# EAGLE design cff3100if (EAGLE 9.6.2)
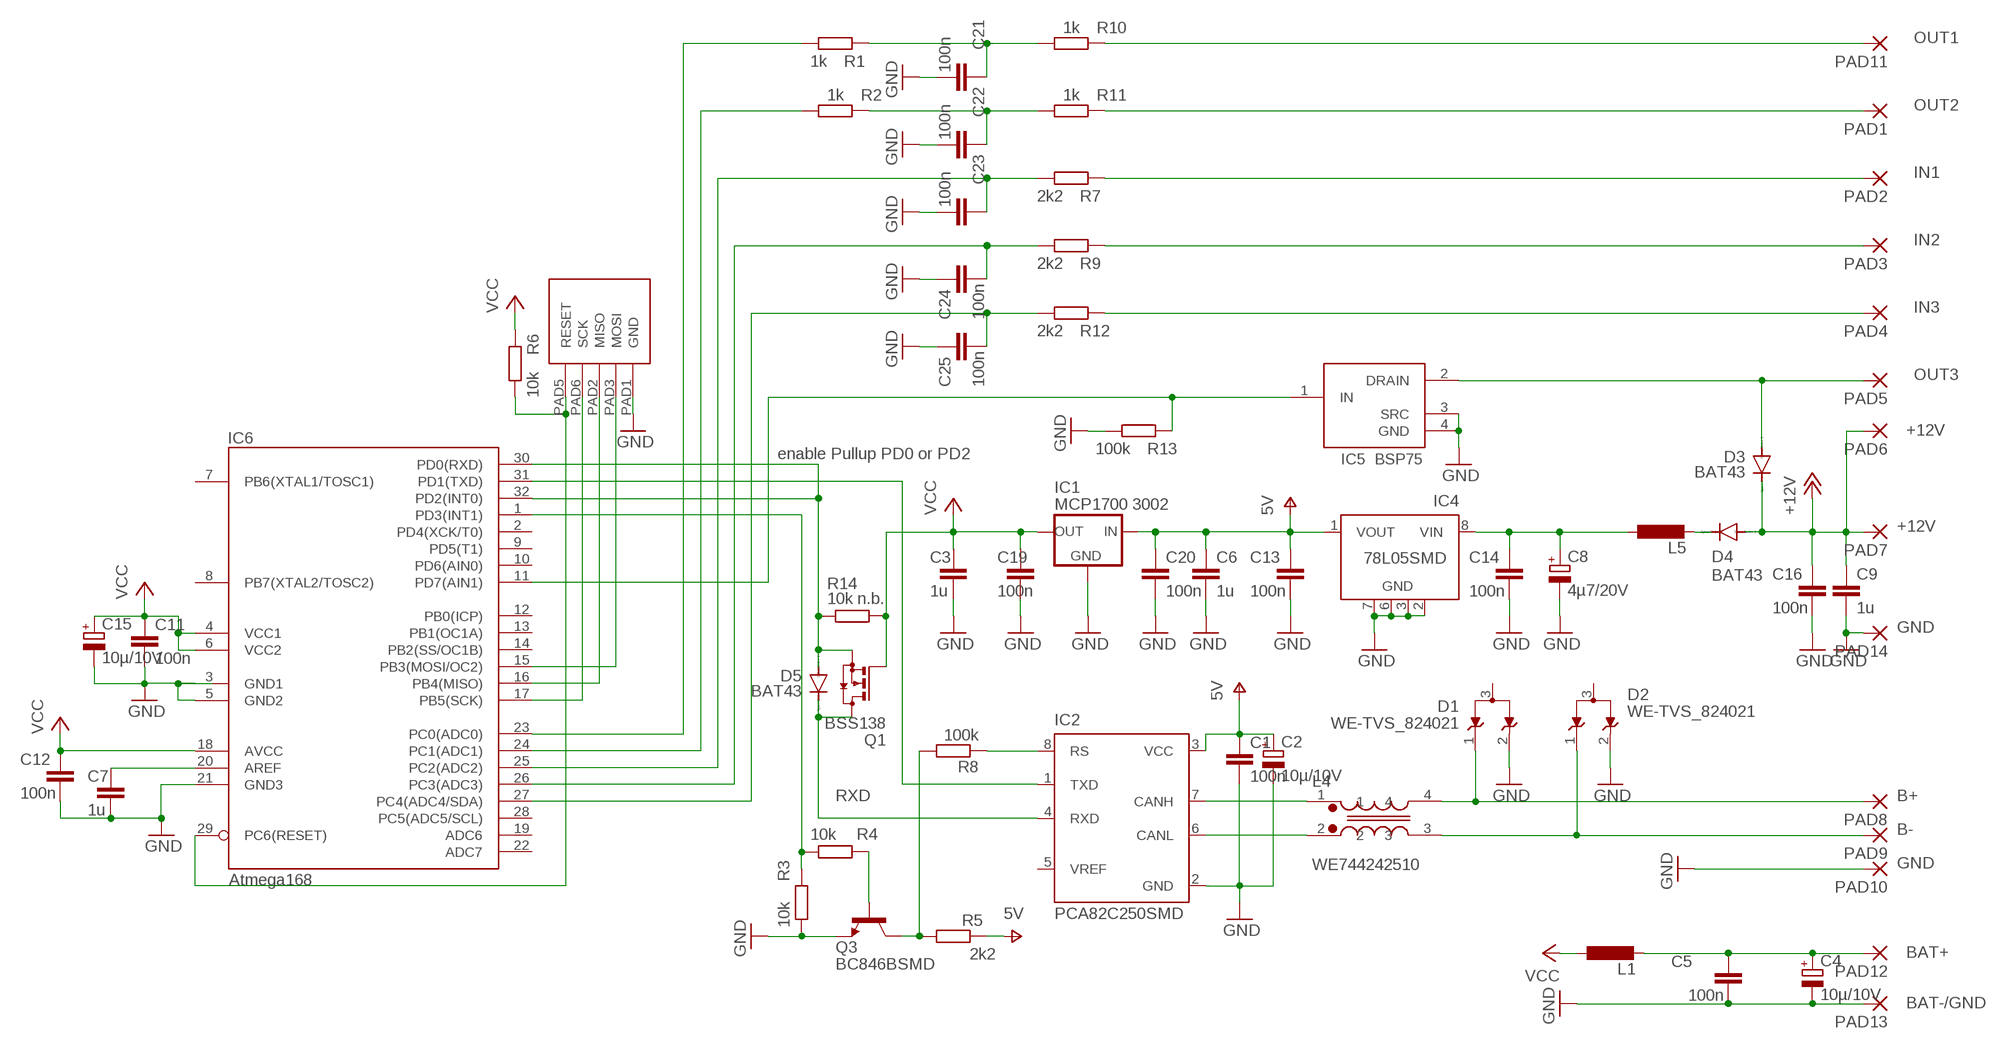
[diagram p0: schematic, sheet 1]

## Parts
C1  100n  C-EUC0603  [C0603]
C2  10µ/10V  CPOL-EUA/3216-18W  [A/3216-18W]
C3  1u  C-EUC1206  [C1206]
C4  10µ/10V  CPOL-EUA/3216-18W  [A/3216-18W]
C5  100n  C-EUC0603  [C0603]
C6  1u  C-EUC1206  [C1206]
C7  1u  C-EUC1206  [C1206]
C8  4µ7/20V  CPOL-EUA/3216-18W  [A/3216-18W]
C9  1u  C-EUC1206  [C1206]
C11  100n  C-EUC0603  [C0603]
C12  100n  C-EUC0603  [C0603]
C13  100n  C-EUC0603  [C0603]
C14  100n  C-EUC0603  [C0603]
C15  10µ/10V  CPOL-EUA/3216-18W  [A/3216-18W]
C16  100n  C-EUC0603  [C0603]
C19  100n  C-EUC0603  [C0603]
C20  100n  C-EUC0603  [C0603]
C21  100n  C-EUC0603  [C0603]
C22  100n  C-EUC0603  [C0603]
C23  100n  C-EUC0603  [C0603]
C24  100n  C-EUC0603  [C0603]
C25  100n  C-EUC0603  [C0603]
D1  WE-TVS_824021  [WE-TVS_SOT23-3L]
D2  WE-TVS_824021  [WE-TVS_SOT23-3L]
D3  BAT43  DIODE-MINIMELF  [MINIMELF]
D4  BAT43  DIODE-MINIMELF  [MINIMELF]
D5  BAT43  DIODE-MINIMELF  [MINIMELF]
IC1  MCP1700 3002  XC63FPM  [SOT23]
IC2  PCA82C250SMD  [SO8]
IC4  78L05SMD  [SO08]
IC5  BSP75  [SOT223]
IC6  Atmega168  ATMEGA8  [TQFP32-08]
L1  L-EUL1806  [L1806]
L4  WE744242510  WE-SLM  [WE-SLM]
L5  L-EUL1806  [L1806]
PAD1  1,6/0,9  [1,6/0,9]
PAD2  1,6/0,9  [1,6/0,9]
PAD3  1,6/0,9  [1,6/0,9]
PAD4  1,6/0,9  [1,6/0,9]
PAD5  1,6/0,9  [1,6/0,9]
PAD6  +12V  1,6/0,9  [1,6/0,9]
PAD7  1,6/0,9  [1,6/0,9]
PAD8  1,6/0,9  [1,6/0,9]
PAD9  1,6/0,9  [1,6/0,9]
PAD10  1,6/0,9  [1,6/0,9]
PAD11  1,6/0,9  [1,6/0,9]
PAD12  BAT+  1,6/0,9  [1,6/0,9]
PAD13  BAT-/GND  1,6/0,9  [1,6/0,9]
PAD14  1,6/0,9  [1,6/0,9]
Q1  BSS138  BSS123  [SOT23]
Q3  BC846BSMD  [SOT23]
R1  1k  R-EU_R0603  [R0603]
R2  1k  R-EU_R0603  [R0603]
R3  10k  R-EU_R0603  [R0603]
R4  10k  R-EU_R0603  [R0603]
R5  2k2  R-EU_R0603  [R0603]
R6  10k  R-EU_R0603  [R0603]
R7  2k2  R-EU_R0603  [R0603]
R8  100k  R-EU_R0603  [R0603]
R9  2k2  R-EU_R0603  [R0603]
R10  1k  R-EU_R0603  [R0603]
R11  1k  R-EU_R0603  [R0603]
R12  2k2  R-EU_R0603  [R0603]
R13  100k  R-EU_R0603  [R0603]
R14  10k n.b.  R-EU_R0603  [R0603]
U$2  ATMEL_ISP  [ATMEL_ISP]

## Nets
+12V: C9.1 C16.1 D3.C D4.A PAD6.1(P) PAD7.1(P)
B+: D1.1 L4.4 PAD8.1(P)
B-: D2.1 L4.3 PAD9.1(P)
GND: C1.2 C2.- C3.2 C4.- C5.2 C6.2 C7.2 C8.- C9.2 C11.2 C12.2 C13.2 C14.2 C15.- C16.2 C19.2 C20.2 C21.2 C22.2 C23.2 C24.1 C25.1 D1.2 D2.2 IC1.1(GND) IC2.2(GND) IC4.2(GND) IC4.3(GND) IC4.6(GND) IC4.7(GND) IC5.3(SRC) IC5.4(GND) IC6.3(GND1) IC6.5(GND2) IC6.21(GND3) PAD10.1(P) PAD13.1(P) PAD14.1(P) Q3.2(E) R3.2 R13.2 U$2.PAD1(GND)
IN1: PAD2.1(P) R7.1
IN2: PAD3.1(P) R9.1
IN3: PAD4.1(P) R12.1
N$1: IC6.29(PC6(RESET)) R6.2 U$2.PAD5(RESET)
N$2: C4.+ C5.1 L1.2 PAD12.1(P)
N$3: IC6.1(PD3(INT1)) R3.1 R4.2
N$4: D4.C L5.2
N$5: IC6.23(PC0(ADC0)) R1.2
N$6: IC6.24(PC1(ADC1)) R2.2
N$8: C21.1 R1.1 R10.2
N$9: C22.1 R2.1 R11.2
N$10: IC2.7(CANH) L4.1
N$11: Q3.3(C) R5.1 R8.2
N$12: Q3.1(B) R4.1
N$13: C23.1 IC6.25(PC2(ADC2)) R7.2
N$14: C24.2 IC6.26(PC3(ADC3)) R9.2
N$15: C25.2 IC6.27(PC4(ADC4/SDA)) R12.2
N$16: IC2.1(TXD) IC6.31(PD1(TXD))
N$17: IC2.6(CANL) L4.2
N$18: D5.A IC6.30(PD0(RXD)) IC6.32(PD2(INT0)) Q1.2(S) R14.2
N$19: IC5.1(IN) IC6.11(PD7(AIN1)) R13.1
N$21: IC6.17(PB5(SCK)) U$2.PAD6(SCK)
N$22: IC6.15(PB3(MOSI/OC2)) U$2.PAD3(MOSI)
N$23: IC6.16(PB4(MISO)) U$2.PAD2(MISO)
N$26: C7.1 IC6.20(AREF)
N$27: IC2.8(RS) R8.1
N$29: C8.+ C14.1 IC4.8(VIN) L5.1
OUT1: PAD11.1(P) R10.1
OUT2: PAD1.1(P) R11.1
OUT3: D3.A IC5.2(DRAIN) PAD5.1(P)
RXD: D5.C IC2.4(RXD) Q1.3(D)
V+: C1.1 C2.+ C6.1 C13.1 C20.1 IC1.3(IN) IC2.3(VCC) IC4.1(VOUT) R5.2 ; supply symbol labelled 5V
VCC: C3.1 C11.1 C12.1 C15.+ C19.1 IC1.2(OUT) IC6.4(VCC1) IC6.6(VCC2) IC6.18(AVCC) L1.1 Q1.1(G) R6.1 R14.1
Unconnected: D1.3(GND) D2.3(GND) IC2.5(VREF) IC4.4(NC) IC4.5(NC) IC6.2(PD4(XCK/T0)) IC6.7(PB6(XTAL1/TOSC1)) IC6.8(PB7(XTAL2/TOSC2)) IC6.9(PD5(T1)) IC6.10(PD6(AIN0)) IC6.12(PB0(ICP)) IC6.13(PB1(OC1A)) IC6.14(PB2(SS/OC1B)) IC6.19(ADC6) IC6.22(ADC7) IC6.28(PC5(ADC5/SCL))

## Notes on the sheet
- enable Pullup PD0 or PD2

## Library data of the parts
C1 C5 C11-C14 C16 C19-C25 = resistor:C-EU: CAPACITOR, European symbol
C2 C4 C8 C15 = rcl:CPOL-EU: POLARIZED CAPACITOR, European symbol
C3 C6 C7 C9 = rcl:C-EU: CAPACITOR, European symbol; SPICEPREFIX: C
D1 D2 = EagleLibrary_Wuerth_Elektronik_eiSos_V6_20140807:WE-TVS_824021: TVS Diode Array WE-TVS, Standard Series - Low capazity - No leakage current - Low clamping voltage - high ESD voltage protection - Uni- and bidirectional protection -- DC Distribution -- Headsets and Accessoires -- PDAs -- Digital Cameras -- MP3-Players -- Touch Panels <http://katalog.we-online.de/media/images/eisos/VarTVS_highspeed_pf2.jpg.jpg> Details see: http://katalog.we-online.de/en/pbs/WE-TVS_High_Speed? Updated by Dan Xu 2014-07-11 2014 (C) Würth Elektronik
D3-D5 = diode:DIODE-: DIODE
IC1 = mylib:XC63FP: Positiv Voltage Regulators www.torex.co.jp/english/product/pro02/pdf/0201_xc62fp.pdf
IC2 = mylib:PCA82C250: CAN CONTROLLER INTERFACE
IC4 = linear:78L*SMD: Positive VOLTAGE REGULATOR
IC5 = mylib:BSP75
IC6 = mylib:ATMEGA8: 8-bit AVR with 8K Bytes In-System Programmable Flash
L1 L5 = mylib:L-EU: INDUCTOR, European symbol
L4 = EagleLibrary_Wuerth_Elektronik_eiSos_V6_20140807:WE-SLM: SMD Common Mode Line Filter WE-SLM - Small size - Low Profile - High Impedance - High current capability up to 300 mA -- USB -- CAN -- Firewire -- Data Lines -- Power supply systems -- Signal Lines <http://katalog.we-online.de/media/images/eisos/IndSLM_pf2.jpg> Details see: http://katalog.we-online.de/en/pbs/WE-SLM?? Updated by Dan Xu 2014-07-11 2014 (C) Würth Elektronik
PAD1-PAD14 = wirepad:1,6/0,9: THROUGH-HOLE PAD
Q1 = transistor-small-signal:BSS123: N-CHANNEL MOS FET
Q3 = transistor-npn:BC846*: NPN Transistor
R1-R7 R9-R14 = rcl:R-EU_: RESISTOR, European symbol
R8 = resistor:R-EU_: RESISTOR, European symbol
U$2 = mylib:ATMEL_ISP

## Board
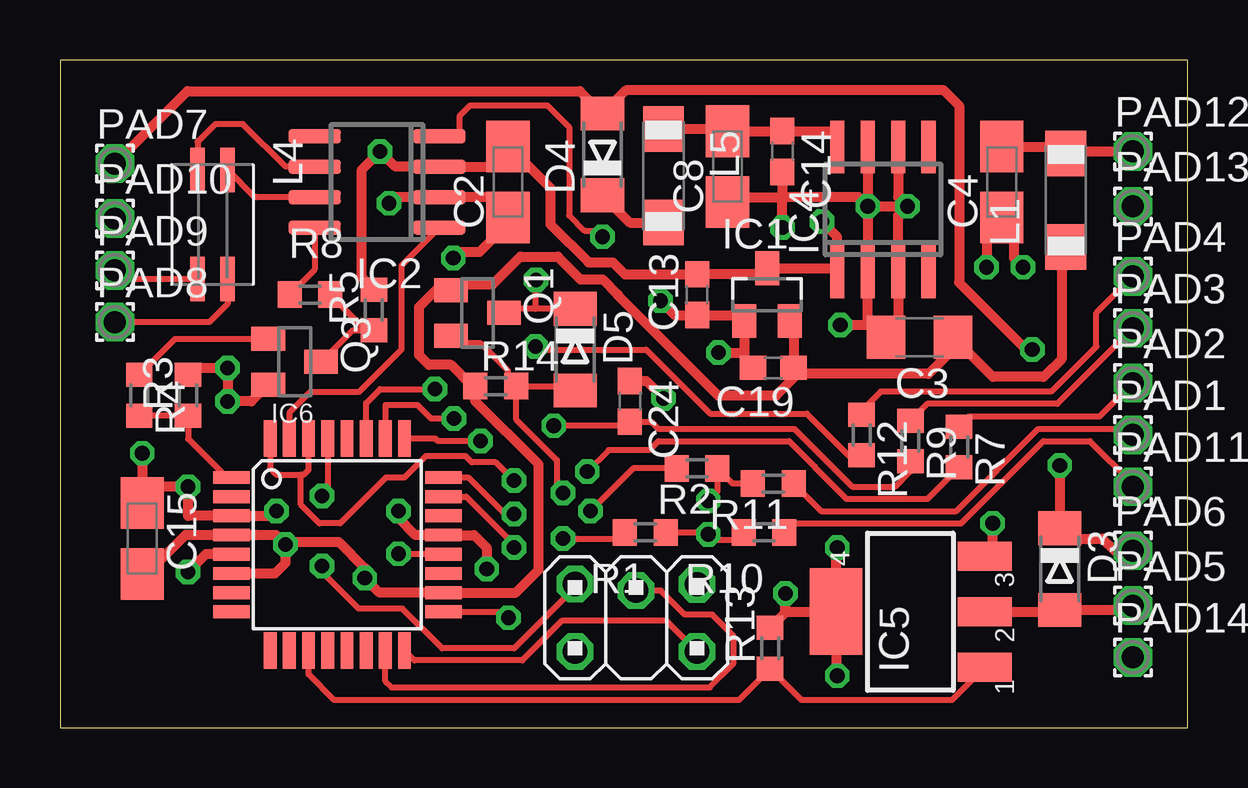
[diagram p1: board, top side]
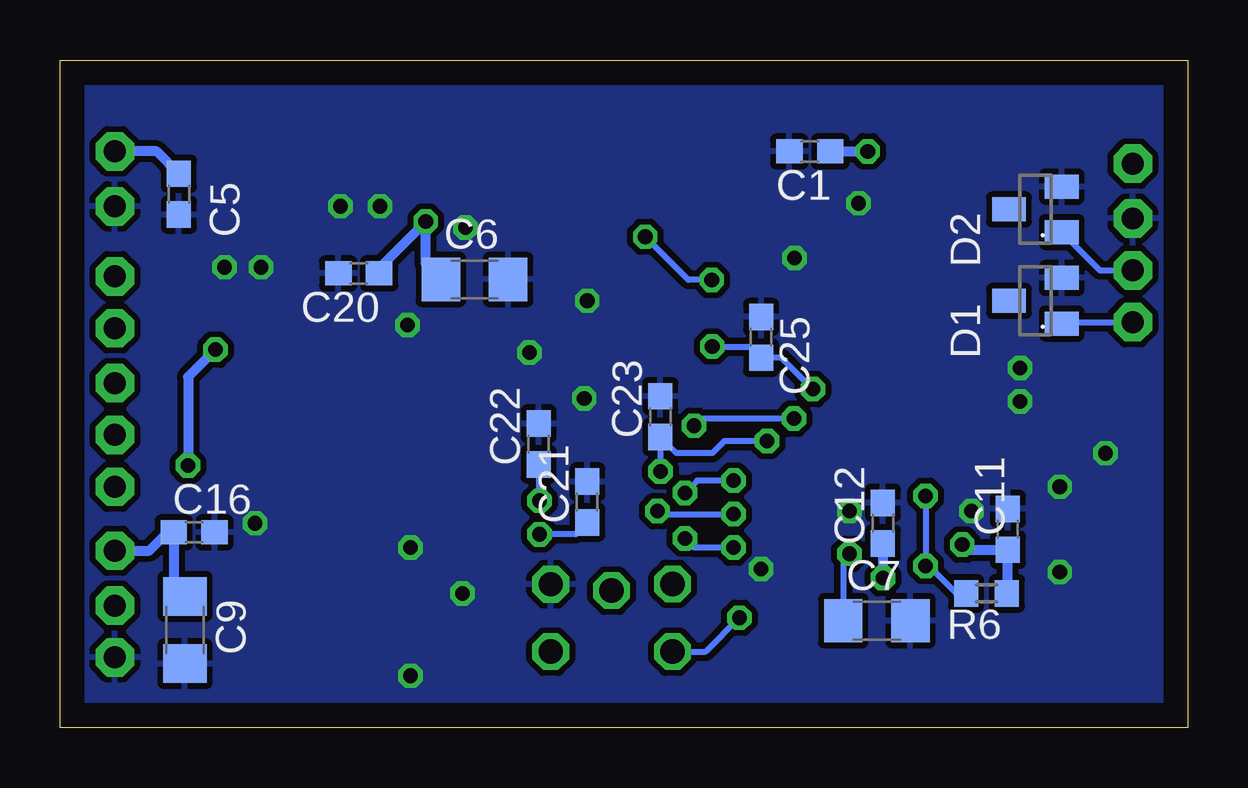
[diagram p2: board, bottom side, seen from below]

Size 46.99 x 27.81 mm. Coordinates in mm from the lower left corner, seen from the top.
Outline: 0,27.81 0,0 46.99,0 46.99,27.81 0,27.81
Copper layers (1*16): Top 0.035mm / dielectric 1.5mm / Bottom 0.035mm
Design rules "Bilex DRU *": minimum track width 10mil, minimum drill 24mil, track to track 10mil, track to pad 10mil, pad to pad 10mil, via to via 10mil, smd to smd 10mil, copper to edge 40mil, drill to drill 8mil, minimum pad ring 10mil, minimum via ring 8mil, stop-mask expansion 4mil, vias tented up to drill 0mil, thermal gap 10mil

### Footprints (pad centres in the part's own frame; a part is rotated, then mirrored left to right if it is on the bottom)
C0603 = smd 1.1 x 1: 1 -0.85,0; 2 0.85,0
A/3216-18W = smd 2.15 x 1.8: + 1.475,0; - -1.475,0
C1206 = smd 1.6 x 1.8: 1 -1.4,0; 2 1.4,0
WE-TVS_SOT23-3L = smd 1 x 1.4: 1 -0.95,-1.1; 2 0.95,-1.1; 3 0,1.1
MINIMELF = smd 1.4 x 1.8: A 1.7,0; C -1.7,0
SOT23 = smd 1 x 1.4: 1 -0.95,-1.1; 2 0.95,-1.1; 3 0,1.1
SO8 = smd 0.6 x 2.2: 1 -1.905,-2.6; 2 -0.635,-2.6; 3 0.635,-2.6; 4 1.905,-2.6; 5 1.905,2.6; 6 0.635,2.6; 7 -0.635,2.6; 8 -1.905,2.6
SO08 = smd 0.6 x 2.2: 1 -1.905,-2.6; 2 -0.635,-2.6; 3 0.635,-2.6; 4 1.905,-2.6; 5 1.905,2.6; 6 0.635,2.6; 7 -0.635,2.6; 8 -1.905,2.6
SOT223 = smd 1.219 x 2.235: 1 -2.311,-3.099; 2 0,-3.099; 3 2.311,-3.099 | smd 3.6 x 2.2: 4 0,3.099
TQFP32-08 = smd 1.524 x 0.533: 1 -4.42,2.8; 2 -4.42,2; 3 -4.42,1.2; 4 -4.42,0.4; 5 -4.42,-0.4; 6 -4.42,-1.2; 7 -4.42,-2; 8 -4.42,-2.8; 17 4.42,-2.8; 18 4.42,-2; 19 4.42,-1.2; 20 4.42,-0.4; 21 4.42,0.4; 22 4.42,1.2; 23 4.42,2; 24 4.42,2.8 | smd 0.533 x 1.524: 9 -2.8,-4.42; 10 -2,-4.42; 11 -1.2,-4.42; 12 -0.4,-4.42; 13 0.4,-4.42; 14 1.2,-4.42; 15 2,-4.42; 16 2.8,-4.42; 25 2.8,4.42; 26 2,4.42; 27 1.2,4.42; 28 0.4,4.42; 29 -0.4,4.42; 30 -1.2,4.42; 31 -2,4.42; 32 -2.8,4.42
L1806 = smd 1.9 x 1.7: 1 -0.68,0; 2 3.22,0
WE-SLM = smd 1.85 x 0.6: 1 -2.28,0.63; 2 -2.28,-0.62; 3 2.27,-0.62; 4 2.27,0.63
1,6/0,9 = drill 0.914 pad 1.6 octagon: 1 0,0
R0603 = smd 1 x 1.1: 1 -0.85,0; 2 0.85,0
ATMEL_ISP = drill 1.016 octagon: PAD1 1.397,-2.54; PAD2 -1.41,-2.54; PAD3 1.13,0; PAD5 1.41,2.54; PAD6 -1.41,2.54

### Placement (x,y rotation side)
C1  15.75,24 180 bottom
C2  18.67,22.73 90 top
C3  35.81,16.26 180 top
C4  39.24,22.73 90 top
C5  42.04,22.23 270 bottom
C6  29.72,18.67 0 bottom
C7  12.95,4.45 0 bottom
C8  27.81,23.37 90 top
C9  41.78,4.06 270 bottom
C11  7.49,8.26 90 bottom
C12  12.7,8.51 90 bottom
C13  26.54,18.03 270 top
C14  30.1,24 270 top
C15  3.43,7.87 270 top
C16  41.4,8.13 0 bottom
C19  29.72,14.99 180 top
C20  34.54,18.92 180 bottom
C21  25.02,9.4 90 bottom
C22  27.05,11.81 90 bottom
C23  21.97,12.95 90 bottom
C24  23.75,13.59 270 top
C25  17.78,16.26 270 bottom
D1  6.35,17.78 90 bottom
D2  6.35,21.59 90 bottom
D3  41.66,6.6 270 top
D4  22.61,23.88 90 top
D5  21.46,15.75 270 top
IC1  29.46,18.03 0 top
IC2  13.21,22.73 90 top
IC4  34.29,21.59 0 top
IC5  35.43,4.83 90 top
IC6  11.56,7.62 0 top
L1  41.91,20.7 90 top
L4  6.35,20.95 270 top
L5  25.15,24.26 270 top
PAD1  44.7,12.19 0 top
PAD2  44.7,14.35 0 top
PAD3  44.7,16.64 0 top
PAD4  44.7,18.8 0 top
PAD5  44.7,5.08 0 top
PAD6  44.7,7.37 0 top
PAD7  2.29,23.5 0 top
PAD8  2.29,16.89 0 top
PAD9  2.29,19.05 0 top
PAD10  2.29,21.21 0 top
PAD11  44.7,10.03 0 top
PAD12  44.7,24 0 top
PAD13  44.7,21.72 0 top
PAD14  44.7,2.92 0 top
Q1  17.4,17.27 270 top
Q3  9.78,15.24 270 top
R1  24.38,8.13 180 top
R2  26.54,10.79 180 top
R3  5.33,13.84 90 top
R4  3.3,13.84 270 top
R5  13.08,17.4 90 top
R6  8.38,5.59 180 bottom
R7  37.47,11.68 270 top
R8  10.41,18.03 0 top
R9  35.43,11.94 270 top
R10  29.34,8.13 180 top
R11  29.72,10.16 180 top
R12  33.4,12.19 270 top
R13  29.59,3.3 90 top
R14  18.16,14.22 0 top
U$2  24,4.57 90 top

### Tracks (layer width: path | path; a pad name or v marks a point on that pad's centre or on a via)
+12V  (via drill 0.61)
  Top 0.406: PAD7.1 5.31,26.52 21.66,26.52 D4.A 23.57,26.54 36.83,26.54 37.47,25.91 37.47,18.54 40.26,15.75 v40.51,15.75 | v41.66,10.92 D3.C 42.09,7.87 43.43,7.87 43.94,7.37 PAD6.1
  Bottom 0.254: C16.1 42.51,8.13 | 42.25,5.93 C9.1
  Bottom 0.406: PAD6.1 43.27,7.37 42.51,8.13 | C16.1 42.25,5.93 | v40.51,15.75 41.66,14.61 v41.66,10.92
B+
  Top 0.254: L4.4 6.98,17.65 6.22,16.89 PAD8.1
  Bottom 0.254: D1.1 5.19,16.89 PAD8.1
B-
  Top 0.254: L4.3 2.65,18.68 PAD9.1
  Bottom 0.254: D2.1 3.66,19.05 PAD9.1
GND  (via drill 0.61)
  Top 0.254: C8.- 28.02,22.1 | 32.33,2.21 v32.38,2.16 | IC5.3 38.86,7.47 | R13.2 30.27,4.83
  Top 0.406: v13.72,21.84 13.97,22.1 IC2.2 17.83,22.1 C2.- 18.67,21 17.48,19.81 16.64,19.81 v16.38,19.56 | C14.2 30.1,22.1 | 28.02,22.1 30.1,22.1 | 32.33,2.21 IC5.4 30.27,4.83 | 38.86,7.47 v38.86,8.51 | R13.2 30.23,4.79 v30.23,5.59 | IC6.5 6.08,7.22 v5.33,6.48 | v14.1,9.02 14.1,8.73 14.81,8.02 IC6.21 17.25,8.02 17.78,7.49 v17.78,6.6 | v30.1,20.83 30.1,22.1 | C24.1 24.42,14.44 v25.15,13.72 | IC4.3 34.92,16.77 C3.2 | C3.2 33.66,17.02 IC4.2 | C3.2 33.91,16.76 v32.51,16.76 | 28.26,17.18 C13.2 25.61,17.18 v25.02,17.78 | 28.51,15.62 28.51,15.34 C19.2 | R3.2 5.63,14.99 v6.99,14.99 v6.99,13.59 7.98,13.59 Q3.2 | v9.02,9.02 8.82,8.82 IC6.3 5.33,8.82 v5.33,10.03 4.11,10.03 C15.- v3.43,11.43 | v27.43,15.62 28.51,15.62 | IC1.1 28.51,15.62 | v38.61,19.18 38.61,20.62 C4.- 39.75,20.75 39.75,19.56 v40.13,19.18
  Top 0.41: IC4.6 34.92,22.1 v35.31,21.72 | IC4.7 v33.66,21.72 | v33.66,21.72 v35.31,21.72 | v33.66,21.72 IC4.2 | IC4.3 34.92,21.34 v35.31,21.72 | v33.66,21.72 33.27,22.1 30.1,22.1 | IC5.4 32.33,7.44 v32.38,7.49
  pour Bottom: 0,27.81 46.99,27.81 46.99,0 0,0
IN1
  Top 0.254: PAD2.1 43.31,12.95 37.88,12.95 R7.1
IN2
  Top 0.254: R9.1 36.13,13.49 41.55,13.49 PAD3.1
IN3
  Top 0.254: PAD4.1 43.18,17.27 43.18,15.88 41.3,13.99 34.19,13.99 33.4,13.21 R12.1
N$1  (via drill 0.61)
  Top 0.254: IC6.29 11.16,9.89 v10.92,9.65 | U$2.PAD5 21.46,5.84 18.92,3.3 15.92,3.3 14.27,4.96 12.44,4.96 10.92,6.48 v10.92,6.73
  Bottom 0.254: R6.2 9.65,5.59 10.79,6.73 v10.92,6.73 v10.92,9.65
N$2
  Top 0.406: L1.2 41.99,24 | 41.99,24 PAD12.1 | C4.+ 41.79,24.21 41.99,24
  Bottom 0.406: C5.1 42.97,24 PAD12.1
N$3
  Top 0.254: IC6.1 6.94,10.42 5.33,12.03 R3.1 R4.2
N$4
  Top 0.406: D4.C 23.75,21.04 L5.2
N$5  (via drill 0.61)
  Top 0.254: IC6.23 16.92,9.62 18.92,7.62 v18.92,7.49 | v20.95,7.87 23.28,7.87 R1.2
  Bottom 0.254: v18.92,7.49 20.57,7.49 v20.95,7.87
N$6  (via drill 0.61)
  Top 0.254: IC6.24 17.01,10.42 18.54,8.89 v18.92,8.89 | v22.1,9.02 23.88,10.79 R2.2
  Bottom 0.254: v22.1,9.02 21.97,8.89 v18.92,8.89
N$8  (via drill 0.61)
  Top 0.254: R10.2 28.16,7.8 27.27,7.8 v27.01,8.05 26.93,8.13 R1.1
  Bottom 0.254: C21.1 25.52,8.05 v27.01,8.05
N$9  (via drill 0.61)
  Top 0.254: R11.2 28.03,10.16 R2.1 27.39,9.83 v27.01,9.45
  Bottom 0.254: v27.01,9.45 27.05,9.45 C22.1
N$10
  Top 0.254: IC2.7 8.12,22.1 L4.1
N$11
  Top 0.254: R8.2 12.75,16.55 R5.1 12.19,16.55 Q3.3
N$12
  Top 0.254: R4.1 4.8,16.19 Q3.1
N$13  (via drill 0.61)
  Top 0.254: v17.53,11.94 15.75,11.94 15.65,12.04 IC6.25 | v21.97,10.67 22.86,11.56 24.55,11.56 24.93,11.94 30.38,11.94 31.45,10.87 31.45,10.84 32.77,9.53 36.16,9.53 R7.2
  Bottom 0.254: v17.53,11.94 19.3,11.94 19.81,11.43 21.3,11.43 C23.1 v21.97,10.67
N$14  (via drill 0.61)
  Top 0.254: v16.41,12.87 15.47,12.87 14.9,13.44 13.56,13.44 13.56,13.43 IC6.26 | R9.2 35.43,10.67 34.8,10.03 33,10.03 30.59,12.45 24.93,12.45 24.64,12.74 C24.2 23.58,12.57 v20.57,12.57
  Bottom 0.254: v16.41,12.87 20.27,12.87 v20.57,12.57
N$15  (via drill 0.61)
  Top 0.254: IC6.27 12.76,13.52 13.34,14.1 v15.62,14.1 | v19.81,15.88 19.94,15.75 24.42,15.75 27.09,13.08 31.11,13.08 32.85,11.34 R12.2
  Bottom 0.254: v19.81,15.88 18.25,15.88 C25.2 16.93,15.41 v15.62,14.1
N$16
  Top 0.254: IC2.1 14.22,19.24 14.22,15.75 12.45,13.97 10.41,13.97 9.56,13.11 IC6.31
N$17
  Top 0.254: IC2.6 9.4,23.37 7.62,25.15 6.48,25.15 5.73,24.4 L4.2
N$18  (via drill 0.61)
  Top 0.254: v20.95,9.78 20.7,10.03 20.7,11.14 19.01,12.83 R14.2 | v18.92,10.29 18.16,11.05 17.16,11.05 16.9,11.3 15.24,11.3 14.35,10.41 13.58,10.41 11.67,8.51 10.81,8.51 10.03,9.28 10.03,10.54 | IC6.32 8.76,10.8 9.02,10.54 10.03,10.54 | IC6.30 10.36,10.74 10.16,10.54 10.03,10.54 | R14.2 21.29,14.22 D5.A | R14.2 18.67,14.57 18.67,14.86 17.53,16 16.62,16 Q1.2
  Bottom 0.254: v18.92,10.29 20.45,10.29 v20.95,9.78
N$19
  Top 0.254: IC6.11 10.36,2.22 11.43,1.14 28.28,1.14 R13.1 30.89,1.15 37.17,1.15 IC5.1
N$21  (via drill 0.61)
  Top 0.254: IC6.17 18.43,4.82 v18.68,4.57
  Bottom 0.254: U$2.PAD6 20.09,3.16 v18.68,4.57
N$22
  Top 0.254: U$2.PAD3 25.03,5.7 26.04,4.7 27.18,4.7 28.07,3.81 28.07,2.67 27.08,1.68 13.82,1.68 13.56,1.94 IC6.15
N$23
  Top 0.254: U$2.PAD2 25.26,4.45 20.91,4.45 19.26,2.79 14.76,2.79 IC6.16
N$26  (via drill 0.61)
  Top 0.254: IC6.20 14.12,7.22 v14.1,7.24
  Bottom 0.254: v14.1,7.24 14.35,6.98 C7.1
N$27
  Top 0.254: IC2.8 10.61,19.08 R8.1
N$29
  Top 0.254: 27.72,24.94 C8.+ 27.82,24.85 | 32.22,24.85 32.38,25.02 IC4.8
  Top 0.406: 27.72,24.94 L5.1 | 27.82,24.85 C14.1 32.22,24.85
OUT1
  Top 0.254: R10.1 30.57,8.51 37.55,8.51 40.98,11.94 42.91,11.94 44.7,10.15 PAD11.1
OUT2
  Top 0.254: R11.1 31.71,9.02 37.34,9.02 40.77,12.45 44.45,12.45 PAD1.1
OUT3
  Top 0.406: IC5.2 41.58,4.83 D3.A 44.53,4.9 PAD5.1
RXD  (via drill 0.61)
  Top 0.254: D5.C 19.81,17.45 | 19.81,17.45 18.68,17.45 Q1.3 | v19.83,18.65 19.81,18.63 19.81,17.45 | v22.61,20.45 22.35,20.7 21.84,20.7 21.21,21.34 21.21,25.02 20.32,25.91 17.08,25.91 16.64,25.47 16.64,24.64 IC2.4
  Bottom 0.254: v22.61,20.45 20.81,18.65 v19.83,18.65
V+  (via drill 0.61)
  Top 0.406: R5.2 12.57,18.76 12.57,23.24 v13.34,24 13.97,23.37 IC2.3 17.83,23.37 C2.+ 18.72,24.21 20.45,22.48 20.45,20.95 22.02,19.38 23.04,19.38 23.53,18.88 C13.1 29.21,18.88 IC1.3 32.24,19.13 IC4.1 32.38,20.45 v31.75,21.08
  Bottom 0.406: C1.1 v13.34,24 | C6.1 31.75,19.3
  Bottom 0.41: C20.1 33.69,19.14 v31.75,21.08 31.75,19.3
VCC  (via drill 0.61)
  Top 0.406: v9.4,7.62 9,8.02 IC6.4 5.23,8.02 3.6,6.4 C15.+ | v9.4,7.62 9.51,7.73 11.61,7.73 12.7,6.64 v12.7,6.22 13.3,5.62 IC6.18 18.99,5.62 19.94,6.57 19.94,10.96 17.31,13.59 R14.1 17.18,14.22 16.3,15.11 15.37,15.11 14.96,15.52 14.96,17.53 15.66,18.22 Q1.1 16.49,18.41 | L1.1 41.73,19.84 41.73,15.35 40.99,14.61 38.87,14.61 C3.1 37.21,15.75 36.2,14.73 30.82,14.73 C19.1 | 22.48,18.67 22.61,18.67 23.24,18.03 23.24,18.01 27.41,13.84 29.84,13.84 30.57,14.57 C19.1 | IC1.2 30.57,16.78 C19.1 | v9.4,7.62 9.4,6.86 8.96,6.42 IC6.6
  Top 0.41: 16.49,18.41 16.54,18.46 18.03,18.46 19.18,19.61 20.74,19.61 21.69,18.67 22.48,18.67
  Bottom 0.406: C12.1 v12.7,6.22 | R6.1 7.49,5.63 C11.1 9.18,7.41 v9.4,7.62